# Altium schematic sheet PIN HEADERS.SchDoc
size B; SheetNumber: 4; SheetTotal: 5
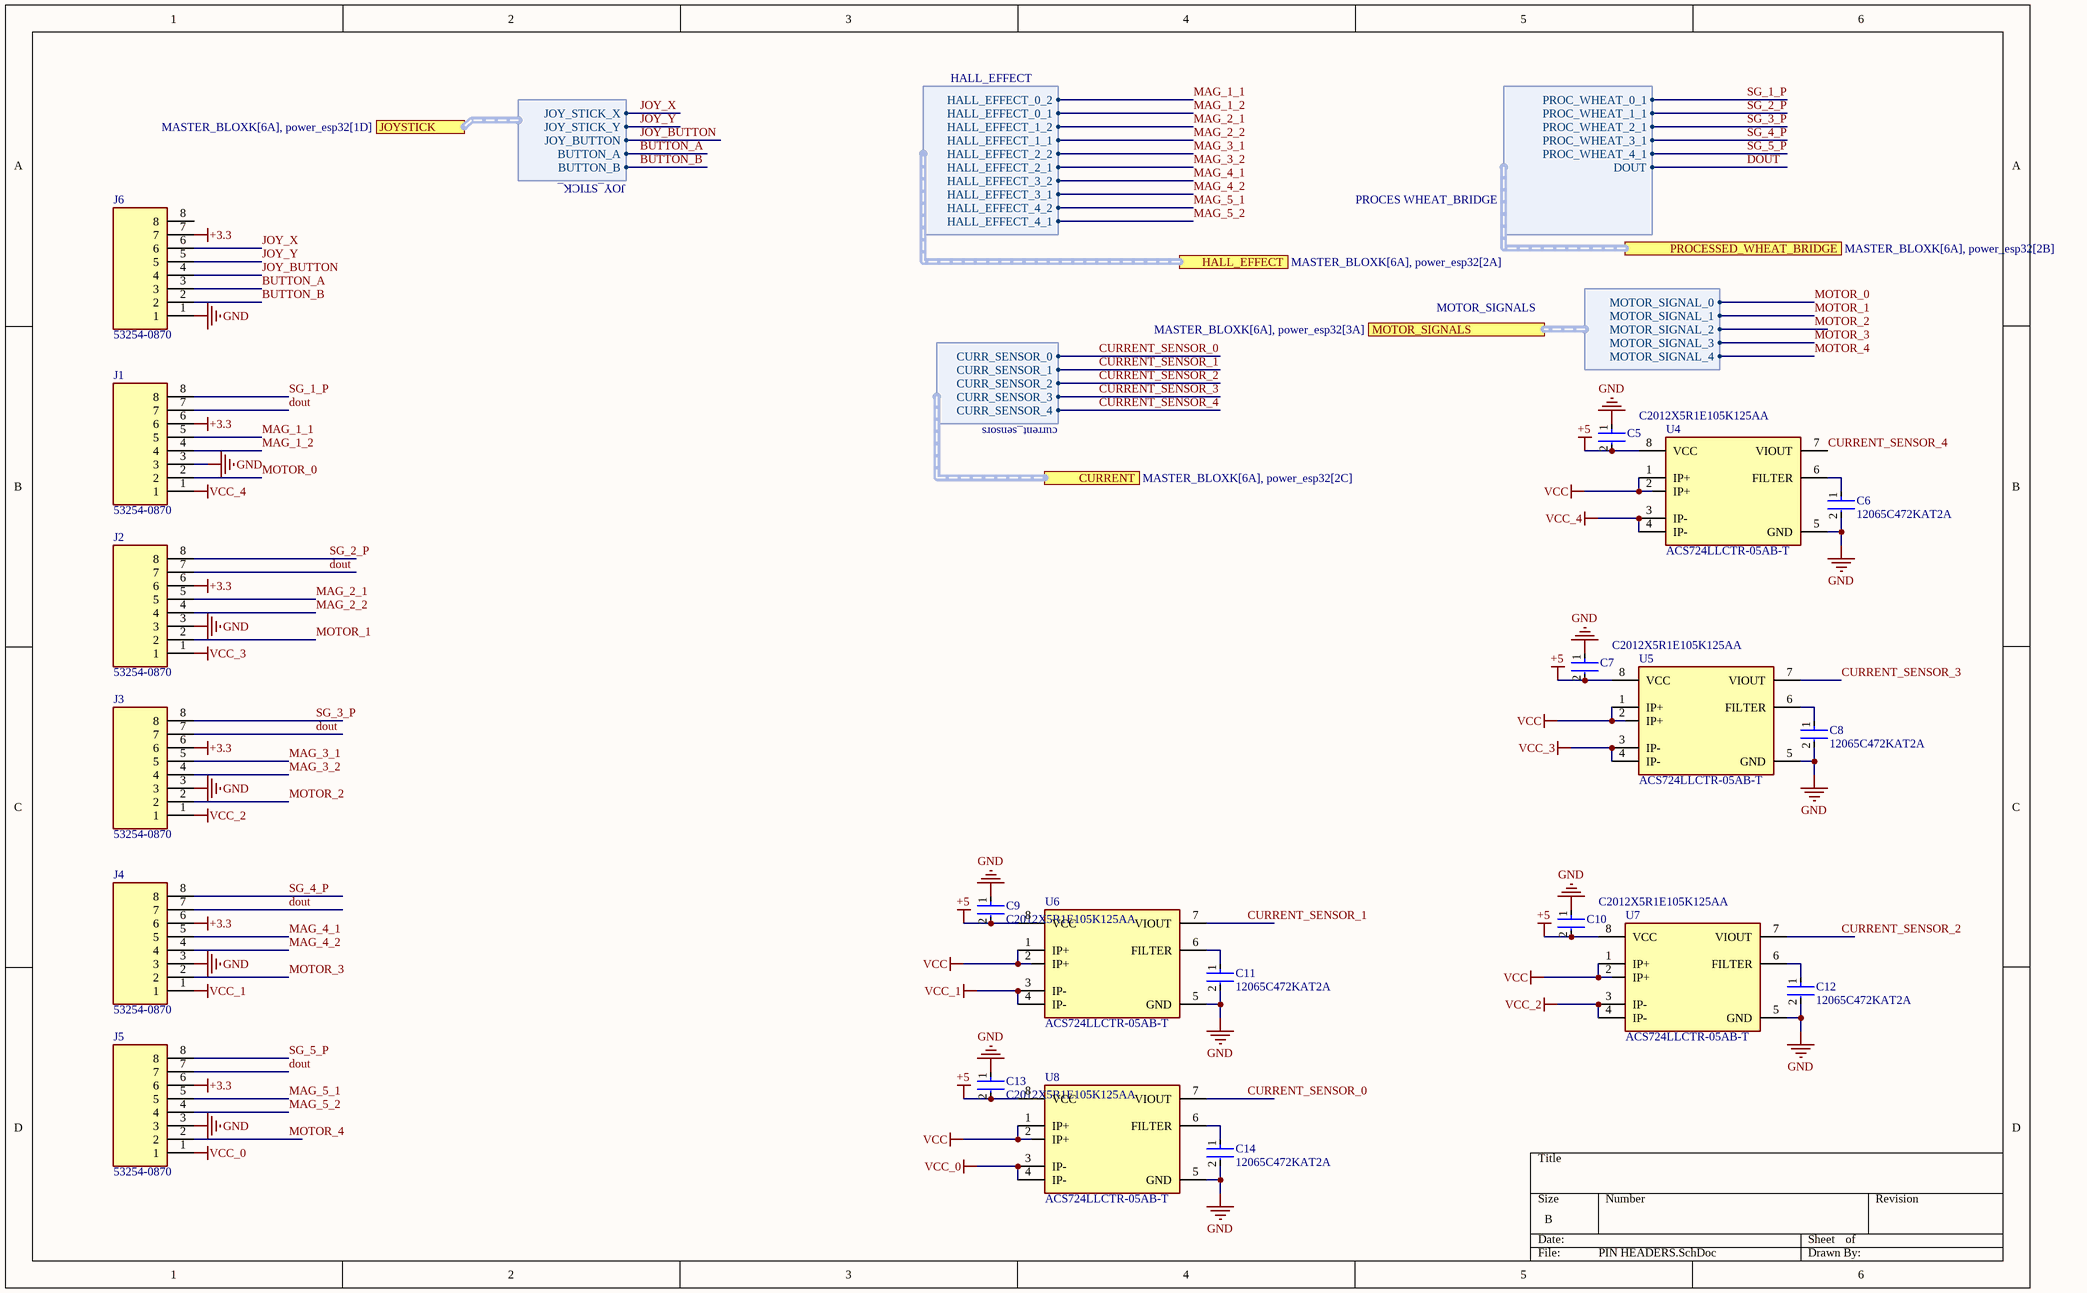
[diagram p0: PIN HEADERS.SchDoc]

## Parts
C5  C2012X5R1E105K125AA  [FP-C2012-125-0_2-IPC_A]
C6  12065C472KAT2A  [FP-1206-L_3_2_0_2-W_1_6_0-IPC_A]
C7  C2012X5R1E105K125AA  [FP-C2012-125-0_2-IPC_A]
C8  12065C472KAT2A  [FP-1206-L_3_2_0_2-W_1_6_0-IPC_A]
C9  C2012X5R1E105K125AA  [FP-C2012-125-0_2-IPC_A]
C10  C2012X5R1E105K125AA  [FP-C2012-125-0_2-IPC_A]
C11  12065C472KAT2A  [FP-1206-L_3_2_0_2-W_1_6_0-IPC_A]
C12  12065C472KAT2A  [FP-1206-L_3_2_0_2-W_1_6_0-IPC_A]
C13  C2012X5R1E105K125AA  [FP-C2012-125-0_2-IPC_A]
C14  12065C472KAT2A  [FP-1206-L_3_2_0_2-W_1_6_0-IPC_A]
J1  53254-0870  [SHDRRA8W50P0X200_1X8_1800X730X440P]
J2  53254-0870  [SHDRRA8W50P0X200_1X8_1800X730X440P]
J3  53254-0870  [SHDRRA8W50P0X200_1X8_1800X730X440P]
J4  53254-0870  [SHDRRA8W50P0X200_1X8_1800X730X440P]
J5  53254-0870  [SHDRRA8W50P0X200_1X8_1800X730X440P]
J6  53254-0870  [SHDRRA8W50P0X200_1X8_1800X730X440P]
U4  ACS724LLCTR-05AB-T  [FP-LCN-8-IPC_C]
U5  ACS724LLCTR-05AB-T  [FP-LCN-8-IPC_C]
U6  ACS724LLCTR-05AB-T  [FP-LCN-8-IPC_C]
U7  ACS724LLCTR-05AB-T  [FP-LCN-8-IPC_C]
U8  ACS724LLCTR-05AB-T  [FP-LCN-8-IPC_C]

## Ports
CURRENT (harness current_sensors, see MASTER_BLOXK[6A], power_esp32[2C]), HALL_EFFECT (harness HALL_EFFECT, see MASTER_BLOXK[6A], power_esp32[2A]), JOYSTICK (harness JOY_STICK_, see MASTER_BLOXK[6A], power_esp32[1D]), MOTOR_SIGNALS (harness MOTOR_SIGNALS, see MASTER_BLOXK[6A], power_esp32[3A]), PROCESSED_WHEAT_BRIDGE (harness PROCES WHEAT_BRIDGE, see MASTER_BLOXK[6A], power_esp32[2B])

## Harnesses
HALL_EFFECT: HALL_EFFECT_2_1, HALL_EFFECT_3_2, HALL_EFFECT_3_1, HALL_EFFECT_4_2, HALL_EFFECT_4_1, HALL_EFFECT_2_2, HALL_EFFECT_1_1, HALL_EFFECT_1_2, HALL_EFFECT_0_1, HALL_EFFECT_0_2
PROCES WHEAT_BRIDGE: PROC_WHEAT_0_1, PROC_WHEAT_1_1, PROC_WHEAT_2_1, PROC_WHEAT_3_1, PROC_WHEAT_4_1, DOUT
current_sensors: CURR_SENSOR_0, CURR_SENSOR_1, CURR_SENSOR_2, CURR_SENSOR_3, CURR_SENSOR_4
MOTOR_SIGNALS: MOTOR_SIGNAL_0, MOTOR_SIGNAL_1, MOTOR_SIGNAL_2, MOTOR_SIGNAL_3, MOTOR_SIGNAL_4
JOY_STICK_: JOY_STICK_X, JOY_STICK_Y, JOY_BUTTON, BUTTON_A, BUTTON_B

## Nets
+3.3: J1.6 J2.6 J3.6 J4.6 J5.6 J6.7
+5: C5.2 C7.2 C9.2 C10.2 C13.2 U4.8(VCC) U5.8(VCC) U6.8(VCC) U7.8(VCC) U8.8(VCC)
GND: C5.1 C6.2 C7.1 C8.2 C9.1 C10.1 C11.2 C12.2 C13.1 C14.2 J1.3 J2.3 J3.3 J4.3 J5.3 J6.1 U4.5(GND) U5.5(GND) U6.5(GND) U7.5(GND) U8.5(GND)
VCC: U4.1(IP+) U4.2(IP+) U5.1(IP+) U5.2(IP+) U6.1(IP+) U6.2(IP+) U7.1(IP+) U7.2(IP+) U8.1(IP+) U8.2(IP+)
VCC_0: J5.1 U8.3(IP-) U8.4(IP-)
VCC_1: J4.1 U6.3(IP-) U6.4(IP-)
VCC_2: J3.1 U7.3(IP-) U7.4(IP-)
VCC_3: J2.1 U5.3(IP-) U5.4(IP-)
VCC_4: J1.1 U4.3(IP-) U4.4(IP-)
BUTTON_A: J6.3 ; port JOYSTICK.BUTTON_A
BUTTON_B: J6.2 ; port JOYSTICK.BUTTON_B
CURRENT_SENSOR_0: U8.7(VIOUT) ; port CURRENT.CURR_SENSOR_0
CURRENT_SENSOR_1: U6.7(VIOUT) ; port CURRENT.CURR_SENSOR_1
CURRENT_SENSOR_2: U7.7(VIOUT) ; port CURRENT.CURR_SENSOR_2
CURRENT_SENSOR_3: U5.7(VIOUT) ; port CURRENT.CURR_SENSOR_3
CURRENT_SENSOR_4: U4.7(VIOUT) ; port CURRENT.CURR_SENSOR_4
dout: J1.7 J2.7 J3.7 J4.7 J5.7 ; port PROCESSED_WHEAT_BRIDGE.DOUT
JOY_BUTTON: J6.4 ; port JOYSTICK.JOY_BUTTON
JOY_X: J6.6 ; port JOYSTICK.JOY_STICK_X
JOY_Y: J6.5 ; port JOYSTICK.JOY_STICK_Y
MAG_1_1: J1.5 ; port HALL_EFFECT.HALL_EFFECT_0_2
MAG_1_2: J1.4 ; port HALL_EFFECT.HALL_EFFECT_0_1
MAG_2_1: J2.5 ; port HALL_EFFECT.HALL_EFFECT_1_2
MAG_2_2: J2.4 ; port HALL_EFFECT.HALL_EFFECT_1_1
MAG_3_1: J3.5 ; port HALL_EFFECT.HALL_EFFECT_2_2
MAG_3_2: J3.4 ; port HALL_EFFECT.HALL_EFFECT_2_1
MAG_4_1: J4.5 ; port HALL_EFFECT.HALL_EFFECT_3_2
MAG_4_2: J4.4 ; port HALL_EFFECT.HALL_EFFECT_3_1
MAG_5_1: J5.5 ; port HALL_EFFECT.HALL_EFFECT_4_2
MAG_5_2: J5.4 ; port HALL_EFFECT.HALL_EFFECT_4_1
MOTOR_0: J1.2 ; port MOTOR_SIGNALS.MOTOR_SIGNAL_0
MOTOR_1: J2.2 ; port MOTOR_SIGNALS.MOTOR_SIGNAL_1
MOTOR_2: J3.2 ; port MOTOR_SIGNALS.MOTOR_SIGNAL_2
MOTOR_3: J4.2 ; port MOTOR_SIGNALS.MOTOR_SIGNAL_3
MOTOR_4: J5.2 ; port MOTOR_SIGNALS.MOTOR_SIGNAL_4
SG_1_P: J1.8 ; port PROCESSED_WHEAT_BRIDGE.PROC_WHEAT_0_1
SG_2_P: J2.8 ; port PROCESSED_WHEAT_BRIDGE.PROC_WHEAT_1_1
SG_3_P: J3.8 ; port PROCESSED_WHEAT_BRIDGE.PROC_WHEAT_2_1
SG_4_P: J4.8 ; port PROCESSED_WHEAT_BRIDGE.PROC_WHEAT_3_1
SG_5_P: J5.8 ; port PROCESSED_WHEAT_BRIDGE.PROC_WHEAT_4_1
NetC6_1: C6.1 U4.6(FILTER)
NetC8_1: C8.1 U5.6(FILTER)
NetC11_1: C11.1 U6.6(FILTER)
NetC12_1: C12.1 U7.6(FILTER)
NetC14_1: C14.1 U8.6(FILTER)

Not connected (* = marked no-connect by the designer): J6 8

## Library data of the parts
C5 C7 C9 C10 C13 = CMP-08246-005389-1: Multilayer Ceramic Capacitors 1μF ±10% 25V X5R SMD 0805; Capacitance: 1uF; Min Operating Temperature: -55°C; Construction: Flat; Package Quantity: 2000; Height: 1.25mm; Resistor Type: Ceramic; Case/Package: 0805; Depth: 1.25mm; Case Code (Metric): 2012; Weight: 0.000194oz; REACH SVHC: No SVHC; Dielectric: X5R; Max Operating Temperature: 85°C; Number of Pins: 2; Thickness: 0.057inch; RoHS Compliant: Yes; Radiation Hardening: No; Lead Free: Lead Free; Case Code (Imperial): 0805; Length: 2mm; Voltage Rating: 25V; Mount: Surface Mount; Voltage Rating (DC): 25V; Packaging: Tape and Reel; Dielectric Material: Ceramic; Termination: SMD/SMT; Voltage: 25V; Tolerance: 10%; Series: C; Width: 0.049inch
C6 C8 C11 C12 C14 = CMP-04427-019159-1: General Purpose Ceramic Capacitor, 1206, 4.7nF, 10%, X7R, 15%, 50V; Dissipation Factor: 2.5%; Min Operating Temperature: -55°C; Length: 3.2mm; Mount: Surface Mount; Case Code (Metric): 3216; Depth: 1.6mm; Voltage Rating (DC): 50V; Dielectric Material: Ceramic; Termination: SMD/SMT; Radiation Hardening: No; Voltage: 50V; Capacitance: 4.7nF; Dielectric: X7R; Series: -; Max Operating Temperature: 125°C; Lead Free: Lead Free; Number of Pins: 2; Tolerance: 10%; Thickness: 0.037inch; Packaging: Tape and Reel; Package Quantity: 1; Case/Package: 1206; Contact Plating: Tin; Construction: Flat; Height: 0.94mm; Voltage Rating: 50V; RoHS Compliant: Yes; Width: 1.6mm; Case Code (Imperial): 1206
J1-J6 = CMP-003-000027-1: Headers & Wire Housings 8CKT WTB R/A; Manufacturer_Name: Molex; Geometry.Height: 4.4mm; Mouser Price/Stock: https://www.mouser.co.uk/ProductDetail/Molex/53254-0870?qs=s16%252Be%252B8QgeFQnKbK1eobMw%3D%3D; Mouser Part Number: 538-53254-0870; Source: 53254-0870.SchLib; Design Item ID: 53254-0870; Manufacturer_Part_Number: 53254-0870; Datasheet Link: https://componentsearchengine.com/Datasheets/2/53254-0870.pdf
U4-U8 = CMP-82923-000070-2: SENSOR CURRENT HALL; Current Sensing: 5A; Number of Channels: 1; Sensitivity: 400mV/A; Linearity: 1.5%; Polarity: Bidirectional; Response Time: 4us; Frequency: 120kHz; Max Supply Current: 14mA; Accuracy: 0.6%; Min Operating Temperature: -40°C; Mount: Surface Mount; Max Operating Temperature: 150°C; Packaging: Tape and Reel; RoHS Compliant: Yes; Case/Package: SOIC